# Altium schematic sheet Relay Drivers.SchDoc: Relay Drivers
size B; DrawnBy: Jasper Yun; SheetNumber: 10; SheetTotal: 11; Competition: SAC 2021; Subteam: Avionics; University: McGill University; Location: Montreal, Quebec; Project: Avionics Project Name; MRT: McGill Rocket Team
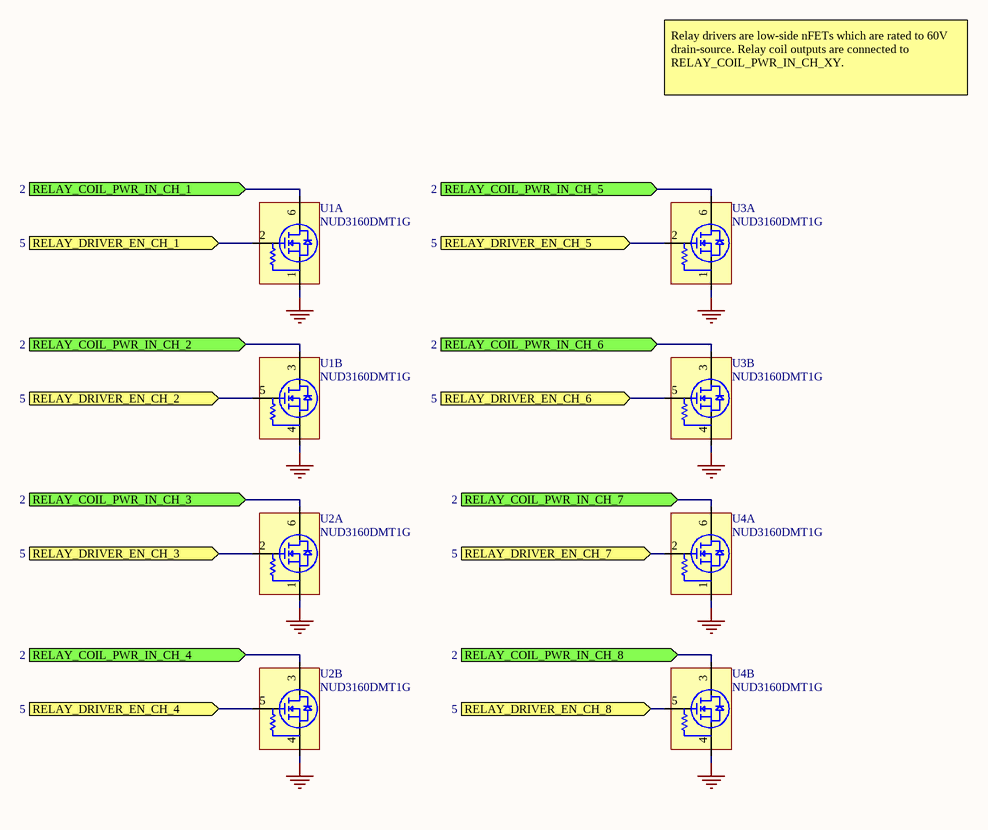
[diagram p0: Relay Drivers.SchDoc]

## Parts
U1  NUD3160DMT1G  [SOT23-6]  (parts A,B of 2)
U2  NUD3160DMT1G  [SOT23-6]  (parts A,B of 2)
U3  NUD3160DMT1G  [SOT23-6]  (parts A,B of 2)
U4  NUD3160DMT1G  [SOT23-6]  (parts A,B of 2)

## Ports
RELAY_COIL_PWR_IN_CH_1 (in, see 2), RELAY_COIL_PWR_IN_CH_2 (in, see 2), RELAY_COIL_PWR_IN_CH_3 (in, see 2), RELAY_COIL_PWR_IN_CH_4 (in, see 2), RELAY_COIL_PWR_IN_CH_5 (in, see 2), RELAY_COIL_PWR_IN_CH_6 (in, see 2), RELAY_COIL_PWR_IN_CH_7 (in, see 2), RELAY_COIL_PWR_IN_CH_8 (in, see 2), RELAY_DRIVER_EN_CH_1 (in, see 5), RELAY_DRIVER_EN_CH_2 (in, see 5), RELAY_DRIVER_EN_CH_3 (in, see 5), RELAY_DRIVER_EN_CH_4 (in, see 5), RELAY_DRIVER_EN_CH_5 (in, see 5), RELAY_DRIVER_EN_CH_6 (in, see 5), RELAY_DRIVER_EN_CH_7 (in, see 5), RELAY_DRIVER_EN_CH_8 (in, see 5)

## Nets
GND: U1.1(Source) U1.4(Source) U2.1(Source) U2.4(Source) U3.1(Source) U3.4(Source) U4.1(Source) U4.4(Source)
RELAY_COIL_PWR_IN_CH_1: U1.6(Drain) ; port RELAY_COIL_PWR_IN_CH_1
RELAY_COIL_PWR_IN_CH_2: U1.3(Drain) ; port RELAY_COIL_PWR_IN_CH_2
RELAY_COIL_PWR_IN_CH_3: U2.6(Drain) ; port RELAY_COIL_PWR_IN_CH_3
RELAY_COIL_PWR_IN_CH_4: U2.3(Drain) ; port RELAY_COIL_PWR_IN_CH_4
RELAY_COIL_PWR_IN_CH_5: U3.6(Drain) ; port RELAY_COIL_PWR_IN_CH_5
RELAY_COIL_PWR_IN_CH_6: U3.3(Drain) ; port RELAY_COIL_PWR_IN_CH_6
RELAY_COIL_PWR_IN_CH_7: U4.6(Drain) ; port RELAY_COIL_PWR_IN_CH_7
RELAY_COIL_PWR_IN_CH_8: U4.3(Drain) ; port RELAY_COIL_PWR_IN_CH_8
RELAY_DRIVER_EN_CH_1: U1.2(Gate) ; port RELAY_DRIVER_EN_CH_1
RELAY_DRIVER_EN_CH_2: U1.5(Gate) ; port RELAY_DRIVER_EN_CH_2
RELAY_DRIVER_EN_CH_3: U2.2(Gate) ; port RELAY_DRIVER_EN_CH_3
RELAY_DRIVER_EN_CH_4: U2.5(Gate) ; port RELAY_DRIVER_EN_CH_4
RELAY_DRIVER_EN_CH_5: U3.2(Gate) ; port RELAY_DRIVER_EN_CH_5
RELAY_DRIVER_EN_CH_6: U3.5(Gate) ; port RELAY_DRIVER_EN_CH_6
RELAY_DRIVER_EN_CH_7: U4.2(Gate) ; port RELAY_DRIVER_EN_CH_7
RELAY_DRIVER_EN_CH_8: U4.5(Gate) ; port RELAY_DRIVER_EN_CH_8

## Notes on the sheet
- Relay drivers are low-side nFETs which are rated to 60V drain-source. Relay coil outputs are connected to RELAY_COIL_PWR_IN_CH_XY.
- Title
- Size:
- Date:
- B
- Revision:
- Time:
- Drawn By:
- Sheet
- of
- File:

## Library data of the parts
U1-U4 = Relay Driver Dual NUD3160DMT1G: IC INDCT LOAD DRVR INDUST SC74-6; Manufacturer: ON Semiconductor; Number of Outputs: 2; Max Supply Voltage: 60V; Rise Time: 600ns; Interface: On/Off; Max Output Current: 150mA; Gate to Source Voltage (Vgs): 12V; Power Dissipation: 380mW; Output Configuration: Low Side; Output Current: 200mA; Output Voltage: 61V; Current Rating: 263mA; Drain to Source Resistance: 1.8R; Element Configuration: Dual; On-State Resistance: 3.7R; Supplier 1: Arrow Electronics; Manufacturer Part Number: NUD3160DMT1G; RoHS: Yes; Category: Hot Swap Controllers; Stock 1: 33; Pricing 1: 1=0.44430, 10=0.32460, 25=0.32120 (USD); Mount: Surface Mount; Case/Package: SC; Number of Pins: 6; Contact Plating: Tin,Matte; Min Operating Temperature: -40°C; Max Operating Temperature: 125°C; Packaging: Tape and Reel; Package Quantity: 3000; Continuous Drain Current (ID): 150mA; Fall Time: 600ns; Number of Elements: 2; Drain to Source Breakdown Voltage: 60V; Drain to Source Voltage (Vdss): 60V; Length: 3mm; Width: 1.5mm; Height: 0.94mm; Radiation Hardening: No; Lead Free: Lead Free; Halogen Free: Halogen Free; RoHS Compliant: Yes; REACH SVHC: No SVHC; ComponentLink1URL: https://datasheet.ciiva.com/1955/nud3160-d-1955024.pdf?src-supplier=Digi-Key; ComponentLink1Description: https://datasheet.ciiva.com/1955/nud3160-d-1955024.pdf?src-supplier=Digi-Key; ComponentLink2URL: https://datasheet.ciiva.com/1609/1786838-1609180.pdf?src-supplier=Newark; ComponentLink2Description: https://datasheet.ciiva.com/1609/1786838-1609180.pdf?src-supplier=Newark; ComponentLink3URL: https://datasheet.ciiva.com/8114/nud3160-d-8114970.pdf?src-supplier=Avnet; ComponentLink3Description: https://datasheet.ciiva.com/8114/nud3160-d-8114970.pdf?src-supplier=Avnet; ComponentLink4URL: https://datasheet.ciiva.com/11168/nud3160-d-11168234.pdf?src-supplier=Avnet; ComponentLink4Description: https://datasheet.ciiva.com/11168/nud3160-d-11168234.pdf?src-supplier=Avnet; ComponentLink5URL: https://datasheet.ciiva.com/1955/nud3160-d-1955025.pdf?src-supplier=Digi-Key; ComponentLink5Description: https://datasheet.ciiva.com/1955/nud3160-d-1955025.pdf?src-supplier=Digi-Key; ComponentLink6URL: https://datasheet.ciiva.com/1955/nud3160-d-1955026.pdf?src-supplier=Digi-Key; ComponentLink6Description: https://datasheet.ciiva.com/1955/nud3160-d-1955026.pdf?src-supplier=Digi-Key; Supplier Part Number 1: NUD3160DMT1G